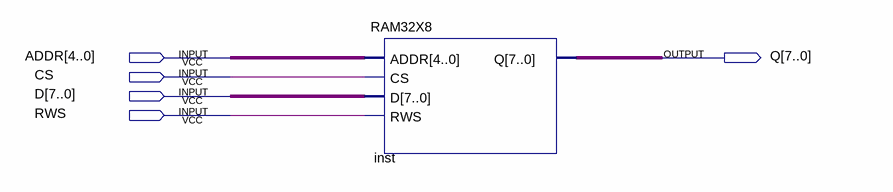
[diagram p0: schematic sheet]
// Quartus schematic TOP.bdf as structural Verilog: 1 symbols, 5 pins
module TOP (
  input  [4:0] ADDR,
  input  CS,
  input  [7:0] D,
  input  RWS,
  output [7:0] Q
);

  RAM32X8 inst (.ADDR(ADDR), .CS(CS), .D(D), .RWS(RWS), .Q(Q));
endmodule
